# Altium schematic sheet Sheet1.SchDoc
size A4; SheetNumber: 1; SheetTotal: 1
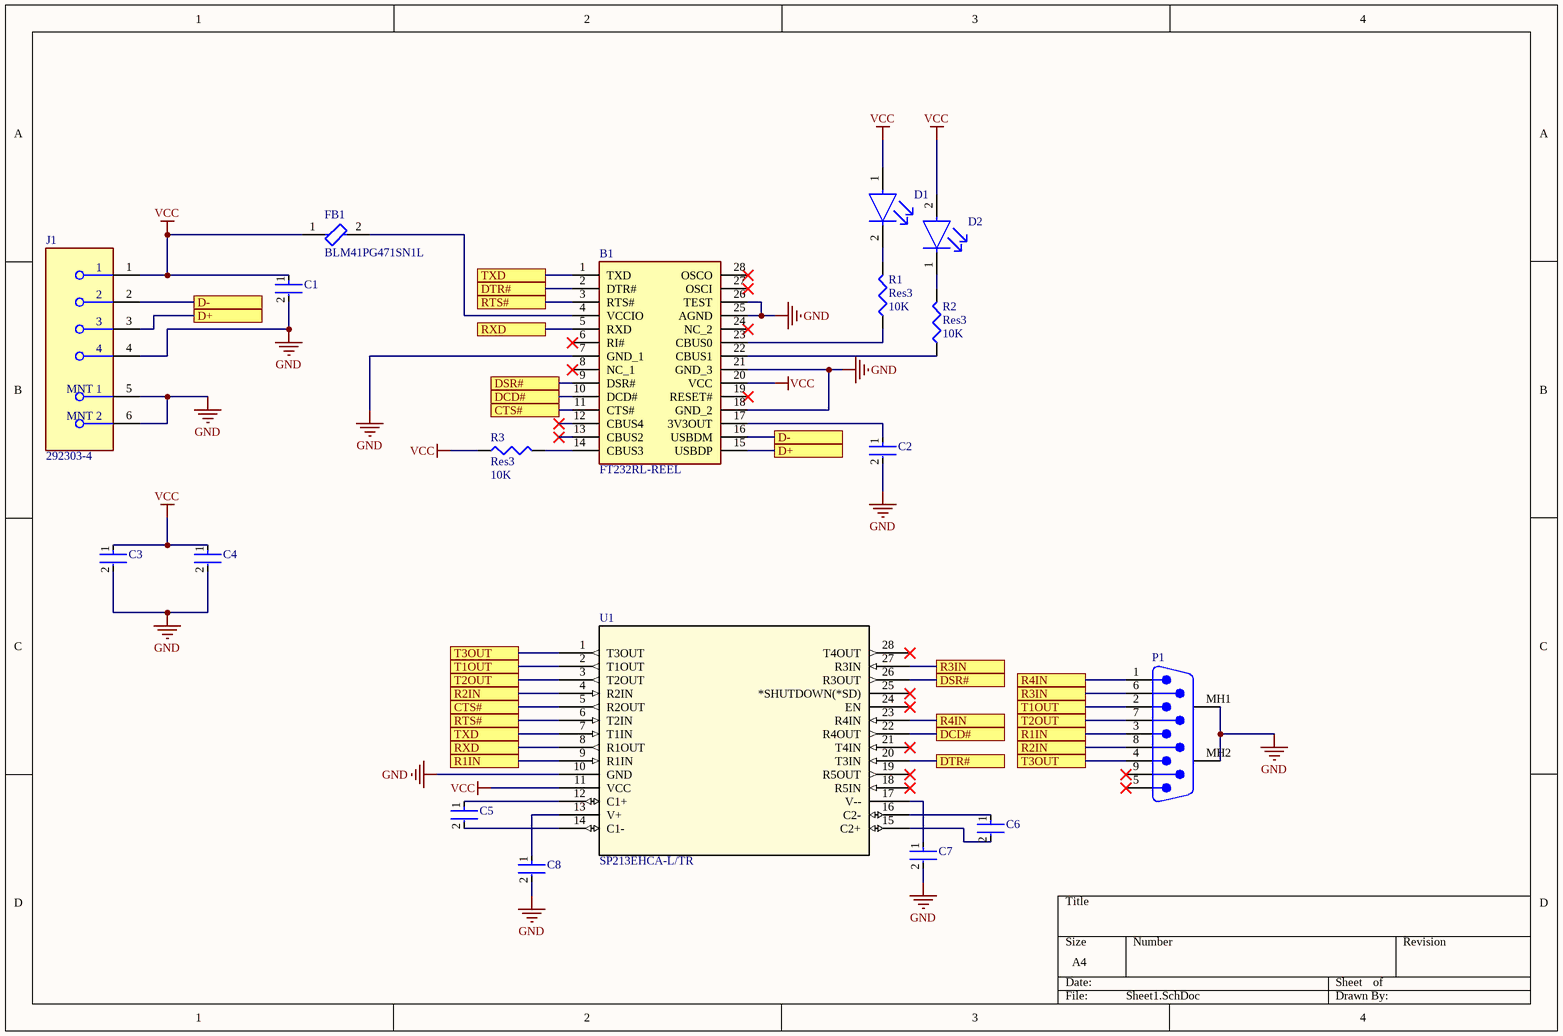
[diagram p0: Sheet1.SchDoc]

## Parts
B1  FT232RL-REEL  [SOP65P780X200-28N]
C1  CC0402KPX7R6BB104  [FP-CC0402-MFG]  (value not drawn)
C2  C0603C104M3VAC  [FP-C0603C-CF-MFG]  (value not drawn)
C3  C0603C104M3VAC  [FP-C0603C-CF-MFG]  (value not drawn)
C4  C0603C104M3VAC  [FP-C0603C-CF-MFG]  (value not drawn)
C5  C0603C104M3VAC  [FP-C0603C-CF-MFG]  (value not drawn)
C6  C0603C104M3VAC  [FP-C0603C-CF-MFG]  (value not drawn)
C7  C0603C104M3VAC  [FP-C0603C-CF-MFG]  (value not drawn)
C8  C0603C104M3VAC  [FP-C0603C-CF-MFG]  (value not drawn)
D1  AP2012EC  [FP-AP2012EC-MFG]  (value not drawn)
D2  APT1608LZGCK  [FP-APT1608LZGCK-MFG]  (value not drawn)
FB1  BLM41PG471SN1L  [FP-BLM41-0_2-a1_2-IPC_B]
J1  292303-4  [FP-292303-4-MFG]
P1  5747840-3  [TECO-5747840-3_V]  (value not drawn)
R1  Res3  value 10K  [J1-0603]
R2  Res3  value 10K  [J1-0603]
R3  Res3  value 10K  [J1-0603]
U1  SP213EHCA-L/TR  [SSOP-28]

## Ports
CTS# (see Sheet1[2B]), CTS# (see Sheet1[2C]), D+ (see Sheet1[1B]), D+ (see Sheet1[2B]), D- (see Sheet1[1B]), D- (see Sheet1[2B]), DCD# (see Sheet1[2B]), DCD# (see Sheet1[3C]), DSR# (see Sheet1[2B]), DSR# (see Sheet1[3C]), DTR# (see Sheet1[2B]), DTR# (see Sheet1[3C]), R1IN (see Sheet1[2C]), R1IN (see Sheet1[3C]), R2IN (see Sheet1[2C]), R2IN (see Sheet1[3C]), R3IN (see Sheet1[3C]), R4IN (see Sheet1[3C]), RTS# (see Sheet1[2B]), RTS# (see Sheet1[2C]), RXD (see Sheet1[2B]), RXD (see Sheet1[2C]), T1OUT (see Sheet1[2C]), T1OUT (see Sheet1[3C]), T2OUT (see Sheet1[2C]), T2OUT (see Sheet1[3C]), T3OUT (see Sheet1[2C]), T3OUT (see Sheet1[3C]), TXD (see Sheet1[2B]), TXD (see Sheet1[2C])

## Nets
GND: B1.7(GND_1) B1.18(GND_2) B1.21(GND_3) B1.25(AGND) B1.26(TEST) C1.2 C2.2 C3.2 C4.2 C7.2 C8.2 J1.4 J1.5(MNT_1) J1.6(MNT_2) P1.MH1 P1.MH2 U1.10(GND)
VCC: B1.20(VCC) C1.1 C3.1 C4.1 D1.1(A) D2.2(A) FB1.1 J1.1 R3.1 U1.11(VCC)
CTS#: B1.11(CTS#) U1.5(R2OUT) ; port CTS#
D+: B1.15(USBDP) J1.3 ; port D+
D-: B1.16(USBDM) J1.2 ; port D-
DCD#: B1.10(DCD#) U1.22(R4OUT) ; port DCD#
DSR#: B1.9(DSR#) U1.26(R3OUT) ; port DSR#
DTR#: B1.2(DTR#) U1.20(T3IN) ; port DTR#
R1IN: P1.3 U1.9(R1IN) ; port R1IN
R2IN: P1.8 U1.4(R2IN) ; port R2IN
R3IN: P1.6 U1.27(R3IN) ; port R3IN
R4IN: P1.1 U1.23(R4IN) ; port R4IN
RTS#: B1.3(RTS#) U1.6(T2IN) ; port RTS#
RXD: B1.5(RXD) U1.8(R1OUT) ; port RXD
T1OUT: P1.2 U1.2(T1OUT) ; port T1OUT
T2OUT: P1.7 U1.3(T2OUT) ; port T2OUT
T3OUT: P1.4 U1.1(T3OUT) ; port T3OUT
TXD: B1.1(TXD) U1.7(T1IN) ; port TXD
NetB1_4: B1.4(VCCIO) FB1.2
NetB1_14: B1.14(CBUS3) R3.2
NetB1_17: B1.17(3V3OUT) C2.1
NetB1_22: B1.22(CBUS1) R2.1
NetB1_23: B1.23(CBUS0) R1.1
NetC5_1: C5.1 U1.12(C1+)
NetC5_2: C5.2 U1.14(C1-)
NetC6_1: C6.1 U1.16(C2-)
NetC6_2: C6.2 U1.15(C2+)
NetC7_1: C7.1 U1.17(V--)
NetC8_1: C8.1 U1.13(V+)
NetD1_2: D1.2(C) R1.2
NetD2_1: D2.1(C) R2.2

Not connected (* = marked no-connect by the designer): B1 6(RI#)* 8(NC_1)* 12(CBUS4)* 13(CBUS2)* 19(RESET#)* 24(NC_2)* 27(OSCI)* 28(OSCO)*; P1 5* 9*; U1 18(R5IN)* 19(R5OUT)* 21(T4IN)* 24(EN)* 25(*SHUTDOWN(*SD))* 28(T4OUT)*

## Library data of the parts
B1 = FT232RL-REEL: USB Bridge, USB to UART USB 2.0 UART Interface 28-SSOP; Manufacturer_Name: FTDI(Future Designs); Geometry.Height: 2mm; Manufacturer_Part_Number: FT232RL-REEL; Mouser Part Number: *; Mouser Price/Stock: *; Arrow Part Number: *; Arrow Price/Stock: *; Datasheet Link: https://datasheet.lcsc.com/szlcsc/Future-Designs-FT232RL-REEL_C8690.pdf
C1 = CMP-03422-001115-1: CC0402 100 nF X7R 10.00% 10 V; Manufacturer: YAGEO; Tolerance: 0.1; Value: 100 nF; Voltage Rating: 10 V; Material: Ceramic; Automotive Grade: NA; Temperature Coefficient: 30ppm/°C; Octopart: https://octopart.com/cc0402kpx7r6bb104-yageo-12885101; Device Class L2: Capacitors; Footprint Url: http://www.yageo.com/exep/pages/download/literatures/UPY-C_GEN_24.pdf; Temperature Range Low: -55°C; Mouser Description: 0402 0.1 uF 10 V ±10% Tolerance X7R SMT Multilayer Ceramic Capacitor; ComponentLink2Description: Datasheet; Lead Free: Yes; Capacitance: 100 nF; Package: CC0402; Ipc Land Pattern Name: CAPC10050X50; Device Class L1: Passive Components; RoHS: TRUE; Automotive: No; ComponentLink2URL: http://www.yageo.com/documents/recent/UPY-GP_NP0_16V-to-50V_16.pdf; Device Class L3: Ceramic Capacitors; Temperature: -55°C to +125°C; Height: 0.55mm; Temperature Characteristic: X7R; Temperature Range High: +125°C; Manufacturer Part Number: CC0402KPX7R6BB104; Category: Cap
C2 C3 = CMP-03020-028681-2: C0603 0.10 μF Y5V 30ppm/°C 20.00% 25 V; Manufacturer: KEMET; Value: 0.10 μF; Voltage Rating: 25 V; Automotive Grade: Grade 1; Material: Ceramic; Tolerance: 0.2; Package: C0603C-CF; Category: Cap; Device Class L2: Capacitors; ComponentLink2Description: Datasheet; Temperature: -55°C to +125°C; Device Class L3: Ceramic Capacitors; Octopart: https://octopart.com/c0603c104m3vac-kemet-1325404; Height: 0.87mm; Mouser Description: Cap .10UF 25V Ceramic Y5V 0603; Manufacturer Part Number: C0603C104M3VAC; Capacitance: 0.10 μF; Lead Free: Yes; Temperature Characteristic: Y5V; Temperature Range Low: -55°C; Temperature Coefficient: 30ppm/°C; Temperature Range High: +125°C; Device Class L1: Passive Components; Automotive: Yes; ComponentLink2URL: https://api.kemet.com/component-edge/download/datasheet/C0603C100J5GACAUTO.pdf; RoHS: TRUE
C4-C8 = CMP-03020-028681-2: C0603 0.10 μF Y5V 30ppm/°C 20.00% 25 V; Manufacturer: KEMET; Value: 4.7uF; Voltage Rating: 25 V; Automotive Grade: Grade 1; Material: Ceramic; Capacitance: 0.10 μF; Tolerance: 0.2; Package: C0603C-CF; Category: Cap; Device Class L2: Capacitors; ComponentLink2Description: Datasheet; Temperature: -55°C to +125°C; Device Class L3: Ceramic Capacitors; Octopart: https://octopart.com/c0603c104m3vac-kemet-1325404; Height: 0.87mm; Mouser Description: Cap .10UF 25V Ceramic Y5V 0603; Manufacturer Part Number: C0603C104M3VAC; Lead Free: Yes; Temperature Characteristic: Y5V; Temperature Range Low: -55°C; Temperature Coefficient: 30ppm/°C; Temperature Range High: +125°C; Device Class L1: Passive Components; Automotive: Yes; ComponentLink2URL: https://api.kemet.com/component-edge/download/datasheet/C0603C100J5GACAUTO.pdf; RoHS: TRUE
D1 = CMP-44529-000070-1: LED RED CLEAR SMD; Forward Voltage: 2V; Test Current: 20mA; Luminous Intensity: 15mcd; Viewing Angle: 120°; Wavelength: 627nm; Dominant Wavelength: 625nm; Lead Free: Lead Free; Length: 2mm; Forward Current: 20mA; Mount: Surface Mount; Packaging: Tape and Reel; Illumination Color: Red; Color: Red; Height: 1.1mm; Case Code (Metric): 2012; Case Code (Imperial): 0805; Case/Package: 0805; Width: 1.25mm; RoHS Compliant: Yes; Package Quantity: 2000; Min Operating Temperature: -40°C; Max Operating Temperature: 85°C; Lens Style: Clear
D2 = CMP-44529-000040-1: LED GREEN CLEAR 2SMD; Dominant Wavelength: 525nm; Forward Voltage: 2.65V; Luminous Intensity: 50mcd; Test Current: 2mA; Viewing Angle: 120°; Lens Color: Colorless; Width: 0.8mm; Mount: Surface Mount; Lens Transparency: Clear; Length: 1.6mm; Packaging: Cut Tape; Case Code (Metric): 1608; Height: 0.75mm; Case/Package: 0603; Case Code (Imperial): 0603; Color: Green
FB1 = CMP-0686-00760-3: Ferrite Bead, 1806, 470Ω @ 100MHz, 25%, 0.05Ω, 2A; Material: Steel; Number of Circuits: 1; Shielding: Unshielded; DC Resistance (DCR): 50mR; Impedance: 470R; Min Operating Temperature: -55°C; Case/Package: 1806; Packaging: Tape and Reel; DC Current: 2A; Frequency: 100MHz; Length: 4.5mm; Max Operating Temperature: 125°C; Package Quantity: 1; Max Current Rating: 2A; Radiation Hardening: No; RoHS Compliant: Yes; Lead Free: Lead Free; Height: 1.6mm; Test Frequency: 100MHz; Series: BLM41P; Width: 1.6mm; Core Material: Ferrite; Case Code (Imperial): 1806; Termination: SMD/SMT; Tolerance: 25%; Number of Pins: 2; Number of Lines: 1; Case Code (Metric): 4516; Current Rating: 2A; Max DC Current: 2A; DC Resistance-Max: 50mR; Depth: 1.6mm; Military Standard: Not
J1 = CMP-03360-000007-1: CONN RCPT USB2.0 TYPEA 4POS R/A; Manufacturer: TE Connectivity; Number Of Contacts: 4; Shielding: true; Current Rating: 1A; Conn Orientation: Right Angle; Voltage Rating: 30V; Description: USB - A USB 2.0 Receptacle Connector 4 Position Through Hole, Right Angle; Is Female: yes; ComponentLink2URL: https://www.te.com/usa-en/product-292303-4.html?te_bu=Cor&te_type=other&te_campaign=oct_glo_cor-oct-global-oth-prtnr-fy19-oct-octo-buy-bom_sma-298_2&elqCampaignId=35216; Category: Conn; Device Class L2: USB Connectors; Usb Standard: USB 2.0; ComponentLink2Description: Datasheet; Package: 292303-4; Temperature Range Low: -55°C; Temperature: -55°C to +85°C; Digikey Description: CONN RCPT USB2.0 TYPEA 4POS R/A; Octopart: https://octopart.com/292303-4-te+connectivity-39545343; Automotive: No; Mouser Description: Modular Connectors / Ethernet Connectors USB A R/A RCPT T/H; Contact Material: Gold,Nickel; Manufacturer Part Number: 292303-4; Device Class L1: Connectors; Device Class L3: unset; Temperature Range High: +85°C; Lead Free: Yes; RoHS: TRUE
P1 = CMP-2000-05647-1: Male D-Sub Connector, Pitch 2.74 mm, 2 Row, 9 Position, Height 12.93 mm, Tail Length 3.17 mm, -55 to 105 degC, RoHS, Tray; Manufacturer: TE Connectivity; Current Rating: 6A; Flange Feature: Housing/Shell(4-40); Catalog Drawings: AMPD-SubMale.318; Dynamic Catalog: AMPLIMITEHD-20Series; Number of Positions: 9; Voltage Rating: 125V; Other Names: A32091; Mating Products: 5-747905-7-ND / -CONND-SUBRCPT9POSVERTSLD / 5-787355-1-ND / -CONNRCPT9POSVERTSOLDERCUP / 5746861-4-ND / -CONNRECEPT9POSGOLDIDC / A32510-ND / -CONND-SUBRCPT9POSSLDCUPAU / AFL09B-ND / -CONND-SUBRECEPT9POS30GOLD / A31975-ND / -CONND-SUBRECEPT9P22-26AWGAU / A31974-ND / -CONND-SUBRECEPT9P20-22AWGAU / A31973-ND / -CONND-SUBRECEPT9P26-30AWGAU / A31931-ND / -CONND-SUBRCPT9POS22-26AWGAU; 3D Model: 5747840-3.pdf; Connector Type: Plug,MalePins; Product Training Modules: AMPLIMITED-SubConnectors; Featured Product: AMPLIMITED-SubminiatureConnectors; Contact Finish Thickness: Flash; Operating Temperature: -55°C~105°C; Shell Material, Finish: Steel,TinPlated; Datasheet URL: http://www.te.com/commerce/DocumentDelivery/DDEController?Action=srchrtrv&DocNm=5747840&DocType=Customer+Drawing&DocLang=English; Shell Size, Connector Layout: 1(DE,E); Package Description: Male D-Sub Connector, Pitch 2.74 mm, 2 Row, 9 Position, Height 12.93 mm, Tail Length 3.17 mm; Package Reference: 5747840-3; Mounting Technology: ThroughHole; Contact Type: Signal; Standard Package: 130; Family: D-SubConnectors; Manufacturer URL: http://www.te.com/; Contact Finish: Gold; Category: Connectors,Interconnects; RoHS Information: 5747840-3StatementofCompliance; Color: Black; Number of Rows: 2; Connector Style: D-Sub; Series: AMPLIMITEHD-20; Mounting Type: ThroughHole,RightAngle; Features: BoardLock,GroundStrap,GroundingIndents; Datasheet Version: Rev. D, 01/2013; Termination: Solder
R1-R3 = Res3: Resistor; Published: 8-Jun-2000; LatestRevisionDate: 29-May-2009; LatestRevisionNote: IPC-7351 Footprint Added.; PackageReference: J1-0603; Publisher: Altium Limited; PackageDescription: Chip Resistor
U1 = SP213EHCA-LTR: No Description Available; Manufacturer_Name: MaxLinear; Copyright: Copyright (C) 2025 Ultra Librarian. All rights reserved.; Manufacturer_Part_Number: SP213EHCA-L/TR; RefDes: RefDes; Type: Type